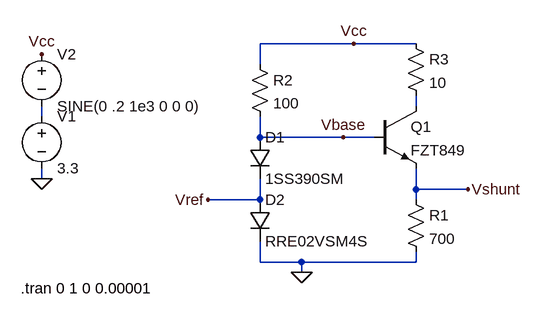
[diagram p0: schematic cc_balance.asc]
cc_balance.asc, the LTspice schematic file:
Version 4.1
SHEET 1 880 680
WIRE 352 -48 208 -48
WIRE 448 -48 352 -48
WIRE 208 -16 208 -48
WIRE 448 48 448 32
WIRE -128 64 -128 48
WIRE 208 96 208 64
WIRE 336 96 208 96
WIRE 384 96 336 96
WIRE -128 160 -128 144
WIRE 448 176 448 144
WIRE 528 176 448 176
WIRE 208 192 208 160
WIRE 208 192 128 192
WIRE 448 192 448 176
WIRE 208 288 208 256
WIRE 272 288 208 288
WIRE 448 288 448 272
WIRE 448 288 272 288
WIRE 272 304 272 288
FLAG -128 160 0
FLAG 272 304 0
FLAG 352 -48 Vcc
FLAG 128 192 Vref
FLAG 528 176 Vshunt
FLAG 336 96 Vbase
FLAG -128 -32 Vcc
SYMBOL voltage -128 48 R0
WINDOW 123 0 0 Left 0
WINDOW 39 0 0 Left 0
SYMATTR InstName V1
SYMATTR Value 3.3
SYMBOL diode 192 96 R0
SYMATTR InstName D1
SYMATTR Value 1SS390SM
SYMBOL res 432 176 R0
SYMATTR InstName R1
SYMATTR Value 700
SYMBOL res 192 -32 R0
SYMATTR InstName R2
SYMATTR Value 100
SYMBOL npn 384 48 R0
SYMATTR InstName Q1
SYMATTR Value FZT849
SYMBOL diode 192 192 R0
SYMATTR InstName D2
SYMATTR Value RRE02VSM4S
SYMBOL res 432 -64 R0
SYMATTR InstName R3
SYMATTR Value 10
SYMBOL voltage -128 -48 R0
WINDOW 123 0 0 Left 0
WINDOW 39 0 0 Left 0
SYMATTR InstName V2
SYMATTR Value SINE(0 .2 1e3 0 0 0)
TEXT -160 328 Left 2 !.tran 0 1 0 0.00001

The netlist it stands for:
* cc_balance.asc
V1 N002 0 3.3
D1 Vbase Vref 1SS390SM
R1 Vshunt 0 700
R2 Vcc Vbase 100
Q1 N001 Vbase Vshunt 0 FZT849
D2 Vref 0 RRE02VSM4S
R3 Vcc N001 10
V2 Vcc N002 SINE(0 .2 1e3 0 0 0)
.model D D
.lib standard.dio
.model NPN NPN
.model PNP PNP
.lib standard.bjt
.tran 0 1 0 0.00001
.backanno
.end